# EAGLE design avoccado-avr-gin (EAGLE 7.2.0)
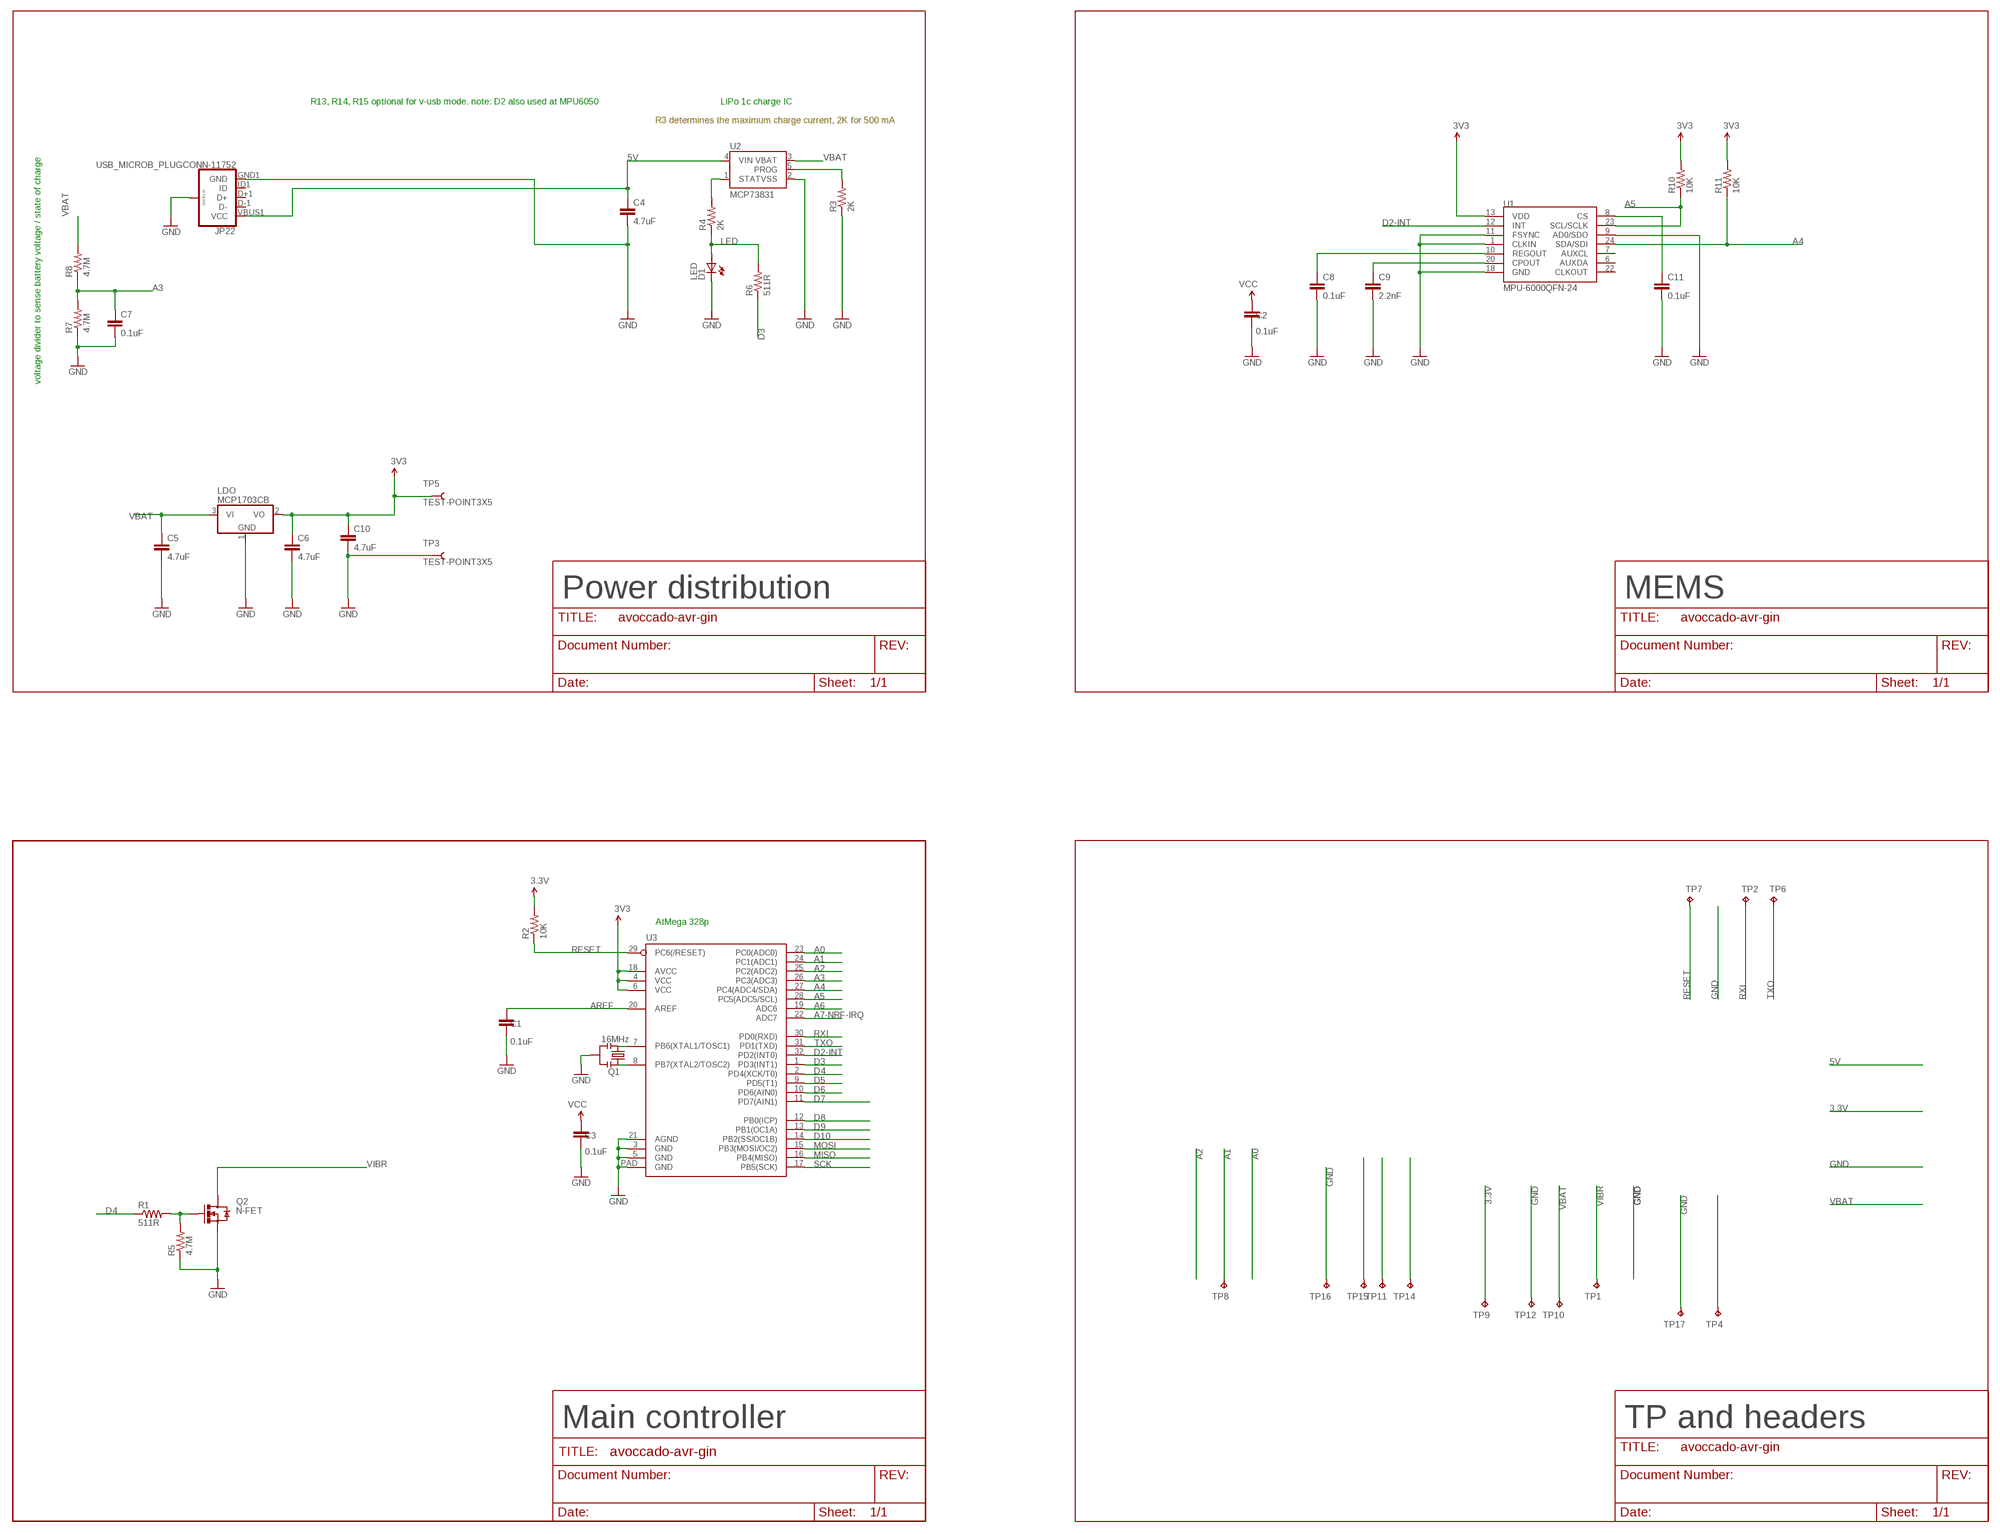
[diagram p0: schematic, sheet 1, part 1 of 2]
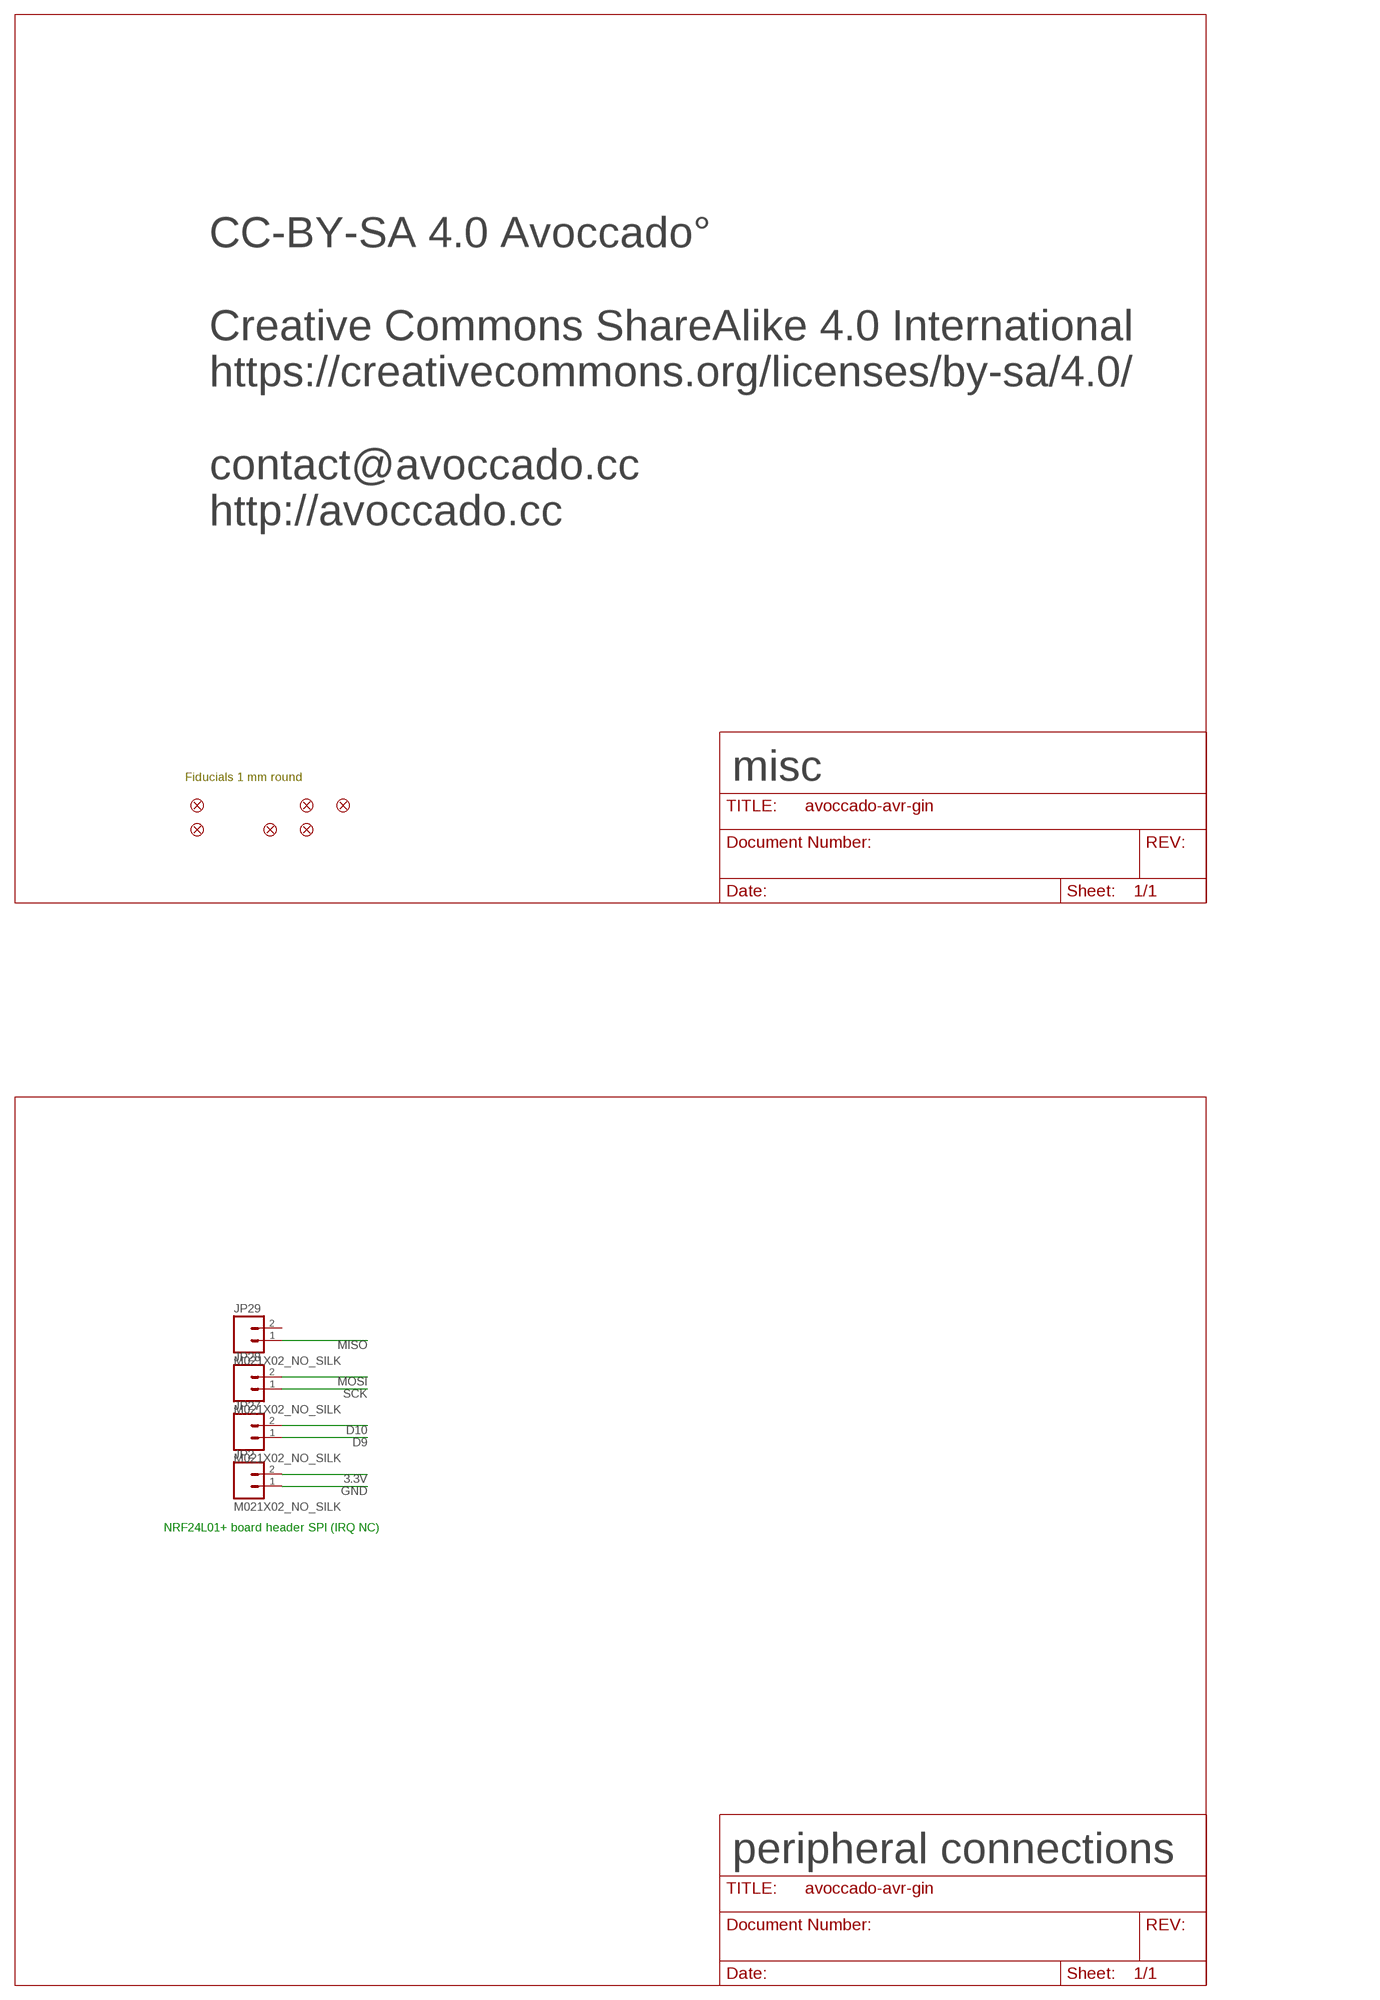
[diagram p1: schematic, sheet 1, part 2 of 2]

## Parts
C1  0.1uF  C-EUC0402K  [C0402K]
C2  0.1uF  C-EUC0402K  [C0402K]
C3  0.1uF  C-EUC0402K  [C0402K]
C4  4.7uF  4.7UF-6.3V-10%(0603)0603  [0603-CAP]
C5  4.7uF  4.7UF-6.3V-10%(0603)0603  [0603-CAP]
C6  4.7uF  4.7UF-6.3V-10%(0603)0603  [0603-CAP]
C7  0.1uF  C-EUC0402K  [C0402K]
C8  0.1uF  C-EUC0402K  [C0402K]
C9  2.2nF  C-EUC0402K  [C0402K]
C10  4.7uF  C-EUC0603  [C0603]
C11  0.1uF  C-EUC0402K  [C0402K]
D1  LED  LED0603  [LED-0603]
FID2  FIDUCIALUFIDUCIAL  [MICRO-FIDUCIAL]
FID4  FIDUCIALUFIDUCIAL  [MICRO-FIDUCIAL]
FID5  FIDUCIALUFIDUCIAL  [MICRO-FIDUCIAL]
FID6  FIDUCIALUFIDUCIAL  [MICRO-FIDUCIAL]
FID8  FIDUCIALUFIDUCIAL  [MICRO-FIDUCIAL]
FID9  FIDUCIALUFIDUCIAL  [MICRO-FIDUCIAL]
JP2  M021X02_NO_SILK  [1X02_NO_SILK]
JP22  USB_MICROB_PLUGCONN-11752  [USB-B-MICRO-SMD_V03]
JP27  M021X02_NO_SILK  [1X02_NO_SILK]
JP28  M021X02_NO_SILK  [1X02_NO_SILK]
JP29  M021X02_NO_SILK  [1X02_NO_SILK]
LDO  MCP1703CB  [SOT23]
Q1  16MHz  RESONATORSMD  [RESONATOR-SMD]
Q2  N-FET  MOSFET-NCHANNELBSS123LT1G  [SOT23-3]
R1  511R  RESISTOR0603  [0603-RES]
R2  10K  RESISTOR0603  [0603-RES]
R3  2K  RESISTOR0603  [0603-RES]
R4  2K  RESISTOR0603  [0603-RES]
R5  4.7M  RESISTOR0603  [0603-RES]
R6  511R  RESISTOR0603  [0603-RES]
R7  4.7M  RESISTOR0603  [0603-RES]
R8  4.7M  RESISTOR0603  [0603-RES]
R10  10K  RESISTOR0603  [0603-RES]
R11  10K  RESISTOR0603  [0603-RES]
TP1  TPTP20R  [TP20R]
TP2  TPTP20R  [TP20R]
TP3  TEST-POINT3X5  [PAD.03X.05]
TP4  TPTP20R  [TP20R]
TP5  TEST-POINT3X5  [PAD.03X.05]
TP6  TPTP20R  [TP20R]
TP7  TPTP20R  [TP20R]
TP8  TPTP20R  [TP20R]
TP9  TPTP20R  [TP20R]
TP10  TPTP20R  [TP20R]
TP11  TPTP20R  [TP20R]
TP12  TPTP20R  [TP20R]
TP14  TPTP20R  [TP20R]
TP15  TPTP20R  [TP20R]
TP16  TPTP20R  [TP20R]
TP17  TPTP20R  [TP20R]
U1  MPU-6000QFN-24  [QFN-24-TESTING]
U2  MCP73831  [SOT23-5]
U3  ATMEGA328P_MLFMLF32  [MLF32-PAD]

## Nets
3.3V: C2.2 C3.2 C6.1 C10.1 JP2.2 LDO.2(VO) R2.2 R10.2 R11.2 TP5.P$1 TP9.TP U1.13(VDD) U3.4(VCC) U3.6(VCC) U3.18(AVCC) ; supply symbol labelled VCC, 3V3
5V: C4.1 JP22.VBUS1(VCC) U2.4(VIN)
A0: U3.23(PC0(ADC0))
A1: TP8.TP U3.24(PC1(ADC1))
A2: U3.25(PC2(ADC2))
A3: C7.1 R7.2 R8.1 U3.26(PC3(ADC3))
A4: R11.1 U1.24(SDA/SDI) U3.27(PC4(ADC4/SDA))
A5: R10.1 U1.23(SCL/SCLK) U3.28(PC5(ADC5/SCL))
A6: U3.19(ADC6)
A7-NRF-IRQ: U3.22(ADC7)
AREF: C1.2 U3.20(AREF)
CHG-PROG: R3.2 U2.5(PROG)
D2-INT: U1.12(INT) U3.32(PD2(INT0))
D3: R6.1 U3.1(PD3(INT1))
D4: R1.1 U3.2(PD4(XCK/T0))
D5: TP15.TP U3.9(PD5(T1))
D6: U3.10(PD6(AIN0))
D7: TP14.TP U3.11(PD7(AIN1))
D8: TP11.TP U3.12(PB0(ICP))
D9: JP27.1 U3.13(PB1(OC1A))
D10: JP27.2 U3.14(PB2(SS/OC1B))
GND [vcc]: C1.1 C2.1 C3.1 C4.2 C5.2 C6.2 C7.2 C8.2 C9.2 C10.2 C11.2 D1.C JP2.1 JP22.GND1(GND) JP22.SHIELD1(SHIELD) JP22.SHIELD2(SHIELD) JP22.SHIELD3(SHIELD) LDO.1(GND) Q1.2 Q2.2(S) R3.1 R5.1 R7.1 TP3.P$1 TP12.TP TP16.TP TP17.TP U1.1(CLKIN) U1.9(AD0/SDO) U1.11(FSYNC) U1.18(GND) U2.2(VSS) U3.3(GND) U3.5(GND) U3.21(AGND) U3.PAD(GND)
LED: D1.A R4.1 R6.2
MISO: JP29.1 U3.16(PB4(MISO))
MOSI: JP28.2 U3.15(PB3(MOSI/OC2))
N$1: Q1.1 U3.8(PB7(XTAL2/TOSC2))
N$2: Q1.3 U3.7(PB6(XTAL1/TOSC1))
N$6: Q2.1(G) R1.2 R5.2
N$7: C8.1 U1.10(REGOUT)
N$8: C9.1 U1.20(CPOUT)
N$10: C11.1 U1.8(CS)
RESET: R2.1 TP7.TP U3.29(PC6(/RESET))
RXI: TP2.TP U3.30(PD0(RXD))
SCK: JP28.1 U3.17(PB5(SCK))
SOC: R4.2 U2.1(STAT)
TXO: TP6.TP U3.31(PD1(TXD))
VBAT [vcc]: C5.1 LDO.3(VI) R8.2 TP4.TP TP10.TP U2.3(VBAT)
VIBR: Q2.3(D) TP1.TP
Unconnected: JP22.D+1(D+) JP22.D-1(D-) JP22.ID1(ID) JP29.2 U1.6(AUXDA) U1.7(AUXCL) U1.22(CLKOUT)

## Notes on the sheet
- R13, R14, R15 optional for v-usb mode. note: D2 also used at MPU6050 | LiPo 1c charge IC
- R3 determines the maximum charge current, 2K for 500 mA
- voltage divider to sense battery voltage / state of charge
- CC-BY-SA 4.0 Avoccado°
  
  Creative Commons ShareAlike 4.0 International
  https://creativecommons.org/licenses/by-sa/4.0/ 
  
  contact@avoccado.cc
  http://avoccado.cc
- Power distribution | MEMS | Fiducials 1 mm round | misc
- AtMega 328p
- NRF24L01+ board header SPI (IRQ NC)
- Main controller | TP and headers | peripheral connections

## Library data of the parts
C1-C3 = resistor:C-EU: CAPACITOR, European symbol
C4-C6 = SparkFun-Capacitors:4.7UF-6.3V-10%(0603): CAP-08280; PROD_ID: CAP-08280
C7-C11 = rcl:C-EU: CAPACITOR, European symbol
D1 = SparkFun:LED: LEDs Standard schematic elements and footprints for 5mm, 3mm, 1206, and 0603 sized LEDs. 5mm - Spark Fun Electronics SKU : COM-00529 (and others)
FID2 FID4-FID6 FID8 FID9 = SparkFun-Aesthetics:FIDUCIAL: Fiducial Alignment Points Various fiducial points for machine vision alignment.
JP2 JP27-JP29 = SparkFun-Connectors:M02: Standard 2-pin 0.1" header. Use with - straight break away headers ( PRT-00116) - right angle break away headers (PRT-00553) - swiss pins (PRT-00743) - machine pins (PRT-00117) - female headers (PRT-00115) Molex polarized connector foot print use with: PRT-08233 with associated crimp pins and housings. 2.54_SCREWTERM for use with PRT-10571. 3.5mm Screw Terminal footprints for PRT-08084 5mm Screw Terminal footprints for use with PRT-08432
JP22 = SparkFun-Connectors:USB_MICROB_PLUG: USB Micro-B connectors Some male, some female. Watch your step!; PROD_ID: CONN-11752
LDO = linear:MCP1703: 250 mA, 16V, Low Quiescent Current LDO Regulator Source: http://ww1.microchip.com/downloads/en/DeviceDoc/22049b.pdf
Q1 = SparkFun:RESONATOR: Resonator Small SMD resonator. This is the itty bitty 10/20MHz resonators with built in caps. CSTCE10M0G55 and CSTCE20M0V53. Footprint has been reviewed closely but hasn't been tested yet.
Q2 = SparkFun-DiscreteSemi:MOSFET-NCHANNEL: Common NMOSFET Parts MFG P/N Store ID Prod ID FDD8780 TRANS-09984 SI7820DN TRANS-11055 FDS6630A IC-08089 2N7002PW TRANS-11151 FQP30N06L COM-10213 TRANS-10060 BSS123LT1G TRANS-08345 BSS138 TRANS-00830 BS170 2N7000; PROD_ID: TRANS-08345
R1-R8 R10 R11 = SparkFun-Resistors:RESISTOR: Resistor Basic schematic elements and footprints for 0603, 1206, and PTH resistors.
TP1 TP2 TP4 TP6-TP12 TP14-TP17 = testpad:TP: Test pad
TP3 TP5 = SparkFun-Passives:TEST-POINT: Bare copper test points for troubleshooting or ICT
U1 = SparkFun-Sensors:MPU-6000: MPU-6000 - I2C address is 0x68 with AD0 low and 0x69 with AD0 high.
U2 = SparkFun:MCP73831: Microchip's MCP73831 Miniature single cell, fully integrated Li-Ion, Li-polymer charge management controller http://ww1.microchip.com/downloads/en/DeviceDoc/21984a.pdf
U3 = SparkFun-DigitalIC:ATMEGA328P_MLF: 32-Pin Atmega328 part Commonly used on Arduino compatible boards Available in QFP and QFN packages TQFP is IC-09069 QFN is non-stock

## Net classes
1 vcc: width 0.152 mm
3 usbvcc: width 0.152 mm, drill 0.61 mm, clearance 0.152 mm

## Board
Avoccado PCB AVR
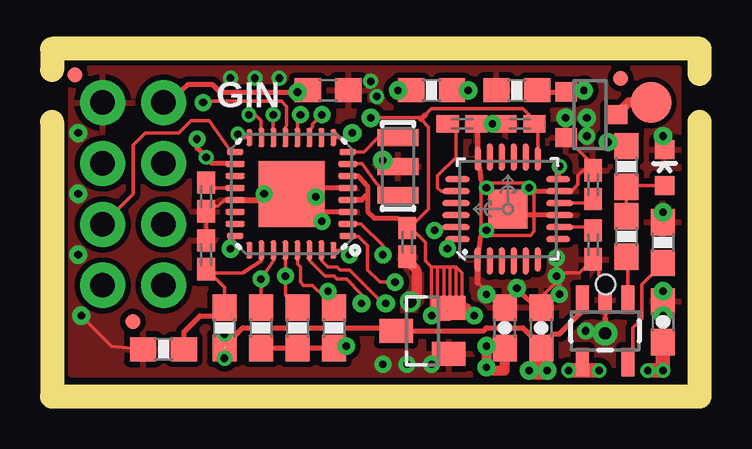
[diagram p2: board, top side]
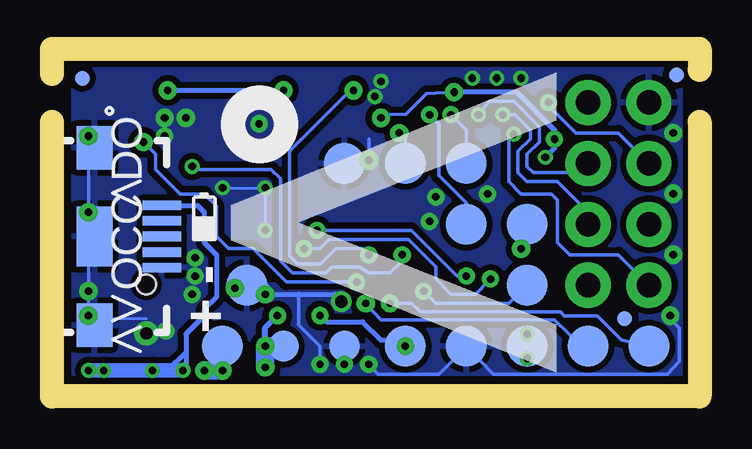
[diagram p3: board, bottom side, seen from below]

No outline drawn. Coordinates in mm, seen from the top.
Copper layers (1*16): Top 0.035mm / dielectric 1.5mm / Bottom 0.035mm
Design rules "SeeedStudio_2layer_DRU_no_angle_20140221 *": minimum track width 6mil, minimum drill 12mil, track to track 6mil, track to pad 6mil, pad to pad 6mil, via to via 6mil, smd to smd 0mil, copper to edge 10mil, drill to drill 10mil, minimum pad ring 10mil, minimum via ring 6mil, stop-mask expansion 0mil, vias tented up to drill 100mil, thermal gap 10mil
tRestrict: area 7.9,6.4 to 12,10.5; area 17.1,5.9 to 20.9,9.7
Milling: 6 lines

### Footprints (pad centres in the part's own frame; a part is rotated, then mirrored left to right if it is on the bottom)
C0402K = smd 0.925 x 0.74: 1 -0.6,0; 2 0.6,0
0603-CAP = smd 1.1 x 1: 1 -0.85,0; 2 0.85,0
C0603 = smd 1.1 x 1: 1 -0.85,0; 2 0.85,0
LED-0603 = smd 0.8 x 0.8: A 0,-0.75; C 0,0.75
MICRO-FIDUCIAL = smd 0.635 x 0.635: 1 0,0
1X02_NO_SILK = drill 1.016 pad 1.88: 1 0,0; 2 2.54,0
USB-B-MICRO-SMD_V03 = smd 1.6 x 0.4: D+1 2.8,0; D-1 2.8,0.65; GND1 2.8,-1.3; ID1 2.8,-0.65; VBUS1 2.8,1.3 | smd 1.5 x 1.8: SHIELD1 0,3.7; SHIELD2 0,-3.7 | smd 1.5 x 2.5: SHIELD3 0,0 | hole 0.8: 2.15,-2
SOT23 = smd 1 x 1.4: 1 -0.95,-1.1; 2 0.95,-1.1; 3 0,1.1
RESONATOR-SMD = smd 0.7 x 1.7: 1 -1.2,0; 2 0,0; 3 1.2,0
SOT23-3 = smd 0.8 x 0.9: 1 -0.95,-1; 2 0.95,-1; 3 0,1.1
0603-RES = smd 1.1 x 1: 1 -0.85,0; 2 0.85,0
TP20R = smd 1.7 x 1.7: TP 0,0
PAD.03X.05 = smd 1.27 x 1.27: P$1 0,0
QFN-24-TESTING = smd 1.016 x 0.254: 1 -2.1,1.257; 6 -2.1,-1.25; 13 2.1,-1.25; 18 2.1,1.25 | smd 1.143 x 0.254: 2 -2.163,0.75; 3 -2.163,0.25; 4 -2.163,-0.25; 5 -2.163,-0.75; 14 2.163,-0.75; 15 2.163,-0.25; 16 2.163,0.25; 17 2.163,0.75 | smd 0.254 x 1.016: 7 -1.25,-2.1; 12 1.25,-2.1; 19 1.25,2.1; 24 -1.25,2.1 | smd 0.254 x 1.143: 8 -0.75,-2.163; 9 -0.25,-2.163; 10 0.25,-2.163; 11 0.75,-2.163; 20 0.75,2.163; 21 0.25,2.163; 22 -0.25,2.163; 23 -0.75,2.163 | smd 1.626 x 1.626: P$1 0,0
SOT23-5 = smd 0.55 x 1.2: 1 -0.95,-1.3; 2 0,-1.3; 3 0.95,-1.3; 4 0.95,1.3; 5 -0.95,1.3
MLF32-PAD = smd 0.7 x 0.25: 1 -2.35,1.75; 8 -2.35,-1.75; 17 2.35,-1.75; 24 2.35,1.75 | smd 0.8 x 0.25: 2 -2.35,1.25; 3 -2.35,0.75; 4 -2.35,0.25; 5 -2.35,-0.25; 6 -2.35,-0.75; 7 -2.35,-1.25; 18 2.35,-1.25; 19 2.35,-0.75; 20 2.35,-0.25; 21 2.35,0.25; 22 2.35,0.75; 23 2.35,1.25 | smd 0.25 x 0.7: 9 -1.75,-2.35; 16 1.75,-2.35; 25 1.75,2.35; 32 -1.75,2.35 | smd 0.25 x 0.8: 10 -1.25,-2.35; 11 -0.75,-2.35; 12 -0.25,-2.35; 13 0.25,-2.35; 14 0.75,-2.35; 15 1.25,-2.35; 26 1.25,2.35; 27 0.75,2.35; 28 0.25,2.35; 29 -0.25,2.35; 30 -0.75,2.35; 31 -1.25,2.35 | smd 2.75 x 2.75: PAD 0,0

### Placement (x,y rotation side)
C1  6.43,8.32 90 top
C2  19.51,11.37 0 top
C3  14.81,6.43 90 top
C4  25.48,3.12 90 top
C5  20.4,2.86 90 top
C6  18.87,2.86 90 top
C7  6.43,5.91 90 top
C8  22.55,8.83 90 top
C9  17.09,11.37 0 top
C10  11.51,12.77 0 top
C11  22.56,6.32 270 top
D1  25.53,9.55 0 top
FID2  0.96,13.4 0 top
FID4  3.38,3.12 0 top
FID5  23.7,13.28 0 top
FID6  3.12,3.24 0 bottom
FID8  0.96,13.4 0 bottom
FID9  25.73,13.28 0 bottom
JP2  2.11,12.26 0 top
JP22  25.22,6.67 0 bottom
JP27  2.11,9.72 0 top
JP28  2.11,7.18 0 top
JP29  2.11,4.64 0 top
LDO  15.44,2.73 90 top
Q1  14.43,9.59 270 top
Q2  22.43,11.75 270 top
R1  15.82,12.77 0 top
R2  11.76,2.86 270 top
R3  25.48,6.42 270 top
R4  23.95,6.67 270 top
R5  19.38,12.77 0 top
R6  23.95,9.59 270 top
R7  4.65,1.97 0 top
R8  7.19,2.86 270 top
R10  10.24,2.86 270 top
R11  8.71,2.86 270 top
TP1  24.97,12.26 0 top
TP2  2.11,2.1 0 bottom
TP3  14.81,2.1 180 bottom
TP4  19.89,2.1 0 bottom
TP5  17.35,2.1 0 bottom
TP6  4.65,2.1 0 bottom
TP7  7.19,4.64 0 bottom
TP8  7.19,7.18 0 bottom
TP9  12.27,2.1 0 bottom
TP10  7.19,2.1 0 bottom
TP11  9.73,9.72 0 bottom
TP12  9.73,2.1 0 bottom
TP14  9.73,7.18 0 bottom
TP15  12.27,9.72 0 bottom
TP16  14.81,9.72 0 bottom
TP17  18.87,4.64 0 bottom
U1  19,7.82 90 top
U2  23.06,2.73 180 top
U3  9.98,8.45 180 top

### Tracks (layer width: path | path; a pad name or v marks a point on that pad's centre or on a via)
3.3V  (via drill 0.3 pad 0.71, 0.3 pad 0.76, 0.32, 0.32 pad 0.71, 0.32 pad 0.76)
  Top 0.127: 20.25,11.01 C2.2 20.11,11.53 | 13.16,8.58 13.16,8.45 | C6.1 | U3.18 7.61,9.72
  Top 0.152: U3.6 12.34,9.21 | 20.25,11.01 U1.13 | 5.16,12.77 JP2.2 | 20.11,11.53 19.63,12.01 15.82,12.01 15.57,11.75 | 15.82,5.4 15.57,5.66 15.57,6.42 14.96,7.03 C3.2 14.91,7.03 15.7,7.82 15.7,11.24 15.38,11.56 15.32,11.62 v13.28,11.62 | 15.82,5.4 16.08,5.4 | 16.08,5.4 16.33,5.4 | 16.33,5.4 16.59,5.4 | 16.59,5.4 16.84,5.4 | 16.84,5.4 17.09,5.15 17.09,3.88 v17.6,3.37 | 16.84,5.4 16.84,3.62 | 16.59,5.4 16.59,3.88 | 16.33,5.4 16.33,3.88 | 16.08,5.4 16.08,3.62 | 15.82,5.4 v15.82,3.37 | v10.24,12.69 10.53,12.64 C10.1 10.74,12.77
  Top 0.203: R11.2 R10.2 R2.2 11.85,2.1 TP9.TP | 13.16,8.45 13.16,7.71 13.44,7.43 14.4,7.43 C3.2 | 7.61,9.72 6.68,9.72 v6.43,9.97 6.04,10.36 v6.04,10.74 | 5.16,12.77 5.41,12.77 5.66,13.02 6.68,13.02 7.01,12.69 v10.24,12.69 10.36,12.64 | 12.91,8.2 13.16,8.45 | U3.6 12.76,9.2 13.16,8.76 13.16,8.45 | 15.57,11.75 15.38,11.56
  Top 0.254: 12.91,8.2 U3.4
  Top 0.406: C6.1 18.78,2.1 v18.11,2.1 v18.11,1.21 18.24,1.08 18.87,1.08 18.87,2.1 | v17.6,3.37 17.29,3.69 LDO.2 | v15.82,3.37 16.59,3.37
  Bottom 0.127: 12.27,11.75 13.16,11.75
  Bottom 0.152: 10.03,12.69 v10.24,12.69 11.38,12.64 12.27,11.75 | 13.16,11.75 v13.28,11.62
  Bottom 0.203: v6.43,9.97 6.04,10.36 v6.04,10.74 6.04,11.12 7.62,12.69 10.03,12.69 | v15.82,3.37 15.57,3.12 14.05,3.12 13.28,2.35 12.52,2.35 TP9.TP
  Bottom 0.254: v18.11,2.1 18.11,2.86 v17.6,3.37
  Bottom 0.762: v18.11,1.21 v18.11,2.1 TP5.P$1
  other vias: 12.27,2.1
5V  (via drill 0.3, 0.32)
  Top 0.127: v21.54,1.08 21.76,1.08 U2.4
  Top 0.61: C4.1 v25.48,1.08 v24.84,1.08 | v21.54,1.08 v22.81,1.08
  Bottom 0.203: JP22.VBUS1 20.93,7.97 20.65,7.69 20.65,6.42 20.14,5.91 20.14,4.13 20.65,3.62 20.65,3.37 21.41,2.61 21.41,1.85 | 21.41,1.85 21.41,1.21 v21.54,1.08 | 21.41,1.85 22.17,1.08
  Bottom 0.61: v25.48,1.08 v24.84,1.08 22.17,1.08 v21.54,1.08
A1  (via drill 0.32 pad 0.76)
  Top 0.127: U3.24 7.57,6.64 v7.44,6.16
  Bottom 0.152: TP8.TP 7.44,6.93 v7.44,6.16
A3
  Top 0.127: 8.73,5.68 8.71,5.66 | 6.26,5.15 C7.1 | R7.2 5.5,2.28
  Top 0.152: U3.26 8.73,5.68 | 8.71,5.66 7.95,5.15 6.26,5.15 | R8.1 7.19,4.55 C7.1
  Top 0.203: 5.5,2.28 5.5,2.7 6.17,3.37 6.85,3.37 R8.1
A4  (via drill 0.32 pad 0.71)
  Top 0.127: 16.73,6.57 U1.24
  Top 0.152: v16.48,6.16 16.73,6.57 | U3.27 9.23,5.67 v8.71,4.89 R11.1
  Bottom 0.152: v16.48,6.16 15.82,6.16 15.44,6.54 12.14,6.54 11,5.4 11,4.89 10.36,4.26 9.35,4.26 v8.71,4.89
A5  (via drill 0.32 pad 0.71)
  Top 0.152: U3.28 v9.73,5.02 9.73,4.22 R10.1 | v15.95,6.93 16.22,7.07 U1.23
  Bottom 0.152: v15.95,6.93 12.01,6.93 10.11,5.02 v9.73,5.02
AREF
  Top 0.152: C1.2 6.65,8.7 U3.20
CHG-PROG
  Top 0.152: R3.2 24.59,4.68 24.59,3.24 24.21,2.86 24.21,1.63 U2.5
D2-INT  (via drill 0.32, 0.32 pad 0.71)
  Top 0.127: U1.12 21.16,9.12
  Top 0.152: 21.16,9.12 v21.16,9.59 | v12.39,5.91 12.21,6.1 U3.32
  Bottom 0.152: v12.39,5.91 12.39,5.66 12.9,5.15 13.79,5.15 14.17,5.4 15.32,5.4 15.57,5.15 16.97,5.15 17.48,5.66 17.48,9.09 17.86,9.47 21.03,9.47 v21.16,9.59
D3  (via drill 0.32 pad 0.71, 0.32 pad 0.76)
  Top 0.152: R6.1 23.79,10.61 v23.19,10.61 | U3.1 12.36,6.67 12.78,6.67 13.16,6.29 13.16,5.28 13.66,4.77 v14.3,4.77
  Bottom 0.152: v14.3,4.77 17.22,4.77 18.62,6.16 19.63,6.16 20.14,6.67 20.14,7.94 20.65,8.45 21.67,8.45 22.68,9.47 22.68,10.1 v23.19,10.61
D4  (via drill 0.3 pad 0.76, 0.32 pad 0.71)
  Top 0.152: U3.2 12.88,7.2 13.79,6.29 v13.79,5.91 | v14.43,12.77 R1.1
  Bottom 0.152: v13.79,5.91 14.05,6.16 15.16,6.16 15.8,5.53 16.76,5.53 17.09,5.86 17.09,10.23 14.55,12.77 v14.43,12.77
D5  (via drill 0.32 pad 0.76)
  Top 0.152: U3.9 12.33,10.8 v12.52,10.99
  Bottom 0.152: TP15.TP 12.27,10.74 v12.52,10.99
D7  (via drill 0.32 pad 0.71)
  Top 0.152: U3.11 10.74,10.81 10.74,11.12 10.87,11.24 10.87,11.37 v11.25,11.75
  Bottom 0.152: v11.25,11.75 10.87,11.37 10.87,9.21 9.73,8.07 TP14.TP
D8  (via drill 0.32 pad 0.71)
  Top 0.152: U3.12 10.23,11.49 v10.36,11.75
  Bottom 0.152: v10.36,11.75 9.73,11.12 TP11.TP
D9  (via drill 0.32 pad 0.71)
  Top 0.152: U3.13 9.73,11.24 9.78,11.29 9.78,12.08 9.58,12.31 6.32,12.31 v6.3,12.26
  Bottom 0.152: v6.3,12.26 6.17,12.01 5.16,10.99 3.38,10.99 JP27.1
D10  (via drill 0.32)
  Top 0.152: U3.14 9.22,10.81 v9.22,11.75
  Bottom 0.152: v9.22,11.75 8.76,12.31 7.75,12.31 6.68,11.24 6.68,10.61 7.19,10.1 7.19,9.59 6.93,9.34 5.03,9.34 JP27.2
GND  (via drill 0.3 pad 0.71, 0.3 pad 0.76, 0.32, 0.32 pad 0.71, 0.32 pad 0.76, 0.32 pad 0.81, 0.51 pad 0.86, 0.51 pad 1.02)
  Top 0.127: R3.1 v25.48,7.69 | 25.48,10.35 D1.C | C4.2 v25.48,4.39 v25.48,3.37 | 22.81,5.47 C11.2 | U2.2 23.06,3.24 | C5.2 19.98,3.71 | 17.74,4.75 18.11,4.39 18.45,4.13 C6.2 | U1.11 21.65,8.56 | C2.1 v18.36,11.37
  Top 0.152: U3.21 7.19,8.2 6.93,7.94 6.64,7.94 C1.1 C7.2 | 12.34,7.69 U3.3 | Q1.2 14.3,9.72 v13.79,9.85 | v25.48,10.86 25.48,10.35 | U2.2 23.06,4.77 22.81,5.02 22.81,5.47 | 19.98,3.71 21.16,4.89 21.41,5.15 21.98,5.15 C11.2 | Q2.2 22.55,9.68 C8.2 22.14,9.43 21.92,9.21 21.92,8.83 21.65,8.56 | v1.22,3.37 2.49,2.1 R7.1 | 11.25,8.7 v11,8.32 | 10.73,7.7 10.73,8.18 v11,8.32 | v8.84,8.45 U3.PAD v11,8.32 | 17.88,9.06 17.88,6.74 17.86,6.72 19.94,6.72 20.09,6.88 20.09,7.43 | 20.09,7.43 20.09,8.81 19.99,8.91 17.91,8.91 | 19.76,7.56 19.96,7.56 20.09,7.43
  Top 0.203: 21.11,8.58 U1.11 19.89,8.56 | U1.9 21.09,7.56 19.76,7.56 | 17.88,9.06 U1.18 17.75,11.32 C9.2 | 17.87,6.68 U1.1 | U3.3 10.73,7.7 | 20.4,3.62 20.27,3.62 v19.38,4.51 19.09,3.71 C6.2 18.32,4.26 v18.11,4.26 | v21.03,5.78 v21.03,5.02 21.16,4.89 v21.16,4.26 | v22.25,2.73 22.81,2.73 v23.06,2.63 23.06,3.24 | U3.5 11.25,8.7
  Top 0.254: U1.1 17.74,4.75 | U3.21 8.59,8.2 v8.84,8.45 | U3.PAD 10.47,8.45 10.73,8.18
  Top 0.406: C3.1 14.81,5.66 15.19,5.28 15.19,4.26 v14.94,3.95
  Bottom 0.127: 23.06,3.24 25.35,3.24 v25.48,3.37 | v18.11,6.93 v18.11,8.7 18.13,8.68 19.86,8.68 v19.89,8.7
  Bottom 0.152: v25.48,10.86 v25.48,7.69 v25.48,4.39 v25.48,3.37 | v15.82,1.34 15.82,2.1 16.71,2.99 16.71,4.26 | v13.79,1.34 13.41,0.93 10.87,0.93 TP12.TP 8.59,0.93 1.35,0.93 0.84,1.47 0.84,2.86 1.22,3.24 v1.22,3.37 | TP16.TP 14.68,9.85 v13.79,9.85 13.79,10.74
  Bottom 0.203: v18.11,4.26 16.71,4.26 15.19,4.26 v14.94,3.95
  Bottom 0.762: v18.11,4.26 18.49,4.64 TP17.TP
  other vias: 14.81,1.34 13.28,13.15 13.54,12.51 22.3,10.86 21.41,11.62 22.3,11.62 9.47,13.28 8.46,13.28 7.44,13.28 1.09,5.91 1.09,8.45 1.09,10.99 11.25,7.31
  pour Bottom (isolate 0.254): 0.77,13.67 26.14,13.67 26.12,0.93 0.77,0.93
  pour Top (isolate 0.229): 0.77,13.67 0.77,0.93 26.12,0.93 26.12,13.69
LED
  Top 0.127: R6.2 24,8.79
  Top 0.152: R6.2 R4.1 | 24,8.79 D1.A
MISO  (via drill 0.32)
  Top 0.152: U3.16 7.89,10.8 v7.75,10.94
  Bottom 0.152: JP29.1 3.38,5.91 5.41,5.91 5.92,6.42 5.92,8.2 6.17,8.45 7.44,8.45 7.95,8.96 7.95,10.74 v7.75,10.94
MOSI  (via drill 0.32 pad 0.61)
  Top 0.152: U3.15 8.71,10.82 8.71,11.5 8.46,11.75 v8.2,11.75
  Bottom 0.152: v8.2,11.75 7.7,11.75 7.06,11.12 7.06,10.74 7.57,10.23 7.57,9.34 7.19,8.96 5.92,8.96 4.65,7.69 JP28.2
N$1
  Top 0.152: U3.8 13,10.2 13.6,10.79 Q1.1
N$2
  Top 0.152: U3.7 12.35,9.72 12.93,9.72 13.54,8.88 13.98,8.39 Q1.3
N$6  (via drill 0.3 pad 0.76)
  Top 0.127: 20.3,12.7 R5.2 | R1.2 17.09,12.77
  Top 0.203: 20.3,12.7 Q2.1 22.11,12.7 v22.17,12.77 | v17.35,12.77 R1.2
  Bottom 0.203: v22.17,12.77 v17.35,12.77
N$7
  Top 0.152: C8.1 22.39,8.06 U1.10
  Top 0.203: U1.10 21.1,8.07
N$8
  Top 0.152: U1.20 16.22,8.56 16.08,8.7 16.08,9.21 16.84,9.97 16.84,11.03 C9.1
N$10
  Top 0.152: C11.1 22.41,7.07 U1.8
RESET  (via drill 0.3 pad 0.71)
  Top 0.127: 11.38,4.13 R2.1 11.51,3.97 v11.51,4.39 | U3.29
  Top 0.152: 11.38,4.13 10.87,4.64 10.49,4.64 10.36,4.77 10.36,5.4 10.24,5.53 U3.29
  Bottom 0.152: v11.51,4.39 11,3.88 7.95,3.88 TP7.TP
RXI  (via drill 0.3 pad 0.76)
  Top 0.152: U3.30 10.73,5.67 11.38,5.02 11.76,5.02 11.89,4.89 12.27,4.89 12.9,4.26 v12.9,3.88
  Bottom 0.152: v12.9,3.88 12.01,3.88 11.63,3.52 5.79,3.52 5.66,3.37 4.27,3.37 3.25,2.35 TP2.TP
SCK
  Top 0.127: U3.17 7.6,10.23 7.44,10.23
  Top 0.152: 7.44,10.23 6.55,11.5 5.79,11.5 5.28,10.99 3.89,10.99 3.38,10.48 3.38,8.45 JP28.1
SOC
  Top 0.127: R4.2 24.01,5.76
  Top 0.152: 24.01,5.76 U2.1
TXO  (via drill 0.3 pad 0.76)
  Top 0.152: v13.92,3.88 13.79,3.88 12.39,5.28 12.01,5.28 11.89,5.4 11.51,5.4 11.23,5.68 U3.31
  Bottom 0.152: TP6.TP 4.9,2.1 6.04,3.19 13.28,3.19 v13.92,3.88
VBAT  (via drill 0.32, 0.32 pad 0.76)  (1 unrouted)
  Top 0.127: R8.2 7.44,2.35 | 13.79,2.61 14.05,2.86 | U2.3 22.33,4.04
  Top 0.152: 14.05,2.86 14.22,2.86 LDO.3
  Top 0.203: 14.05,2.86 7.95,2.86 7.44,2.35 v7.19,2.61 v7.19,1.59 | LDO.3 17.98,2.73 18.11,2.86 19.63,2.86 20.4,2.1 | 20.4,2.1 C5.1 | 20.4,2.1 20.9,2.61 21.16,2.61 22.11,3.56 U2.3
  Top 0.762: v19.89,1.08 v20.65,1.08 20.4,1.34 C5.1
  Bottom 0.152: TP4.TP 19.89,1.85 v20.65,1.08
  Bottom 0.762: v20.65,1.08 v19.89,1.08
VIBR
  Top 0.406: TP1.TP 24.04,12.26 Q2.3

### Text on the board
tPlace: GIN
bPlace: OCC DO | - | +